# Altium project LKS_EVB_MCU081_V2.0.PrjPcb
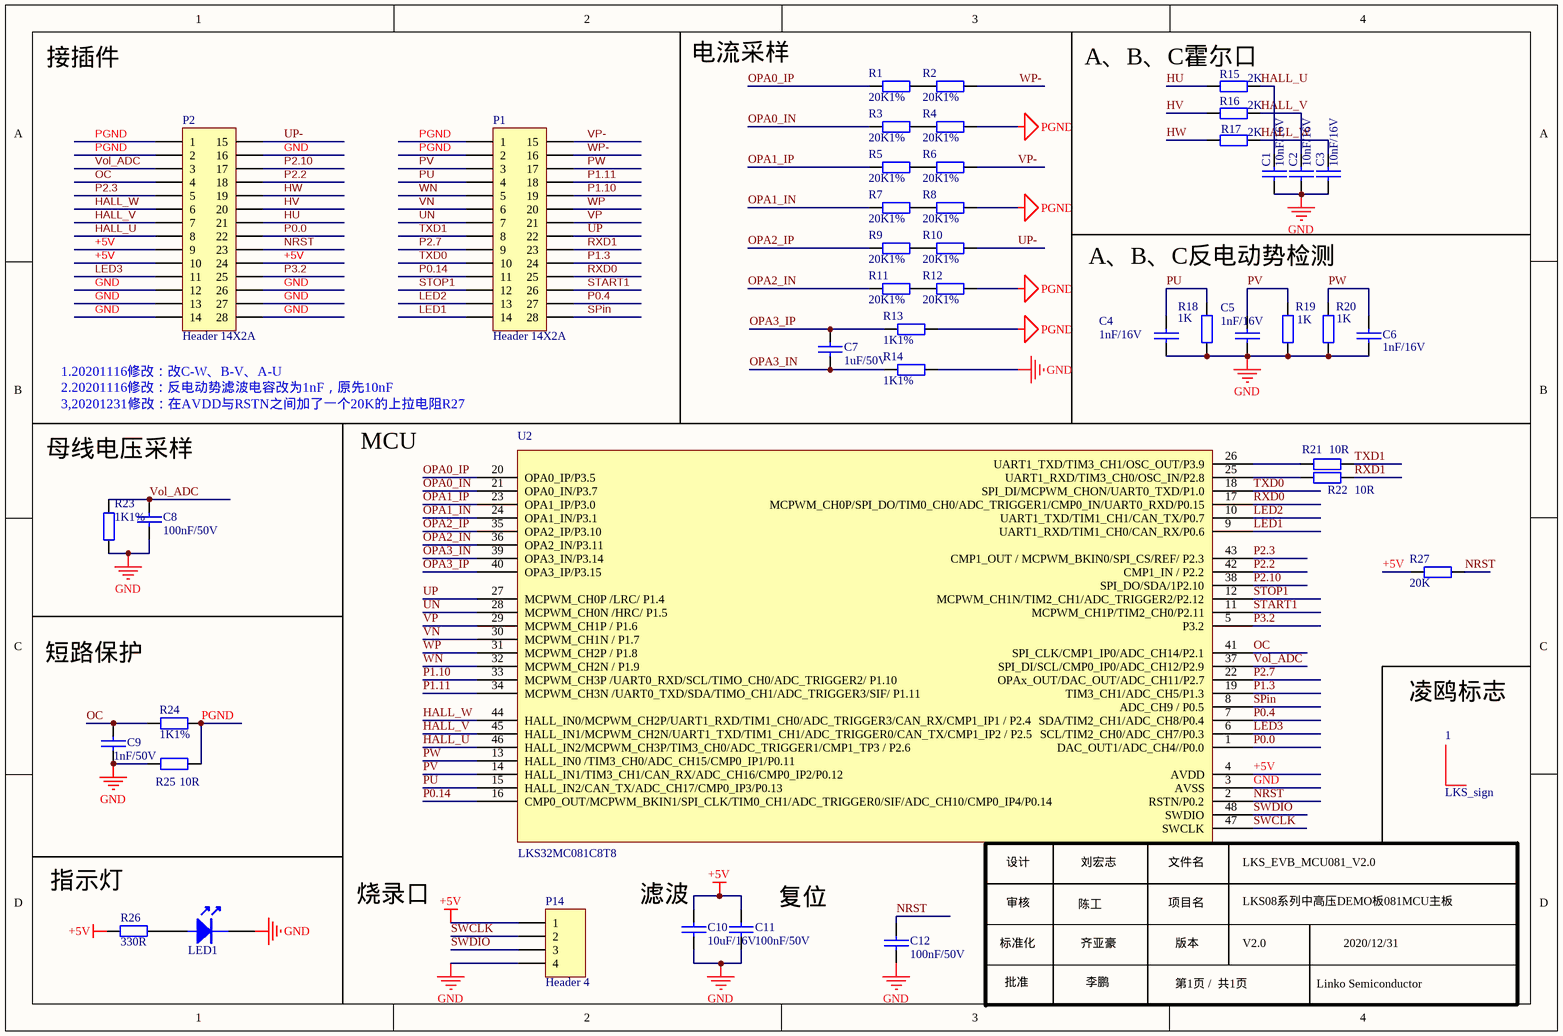
[diagram p0: LKS_EVB_MCU081_V2.0.SchDoc]
1 sheet, 45 parts. Net scope: global (net labels, ports and power ports of the same name join across sheets).
Board file: LKS_EVB_MCU081_V2.0.PcbDoc

## Sheet LKS_EVB_MCU081_V2.0.SchDoc
size A4; SheetNumber: 1; SheetTotal: 1

### Parts
1  LKS_sign  [LKS_LOGO2]
C1  10nF/16V  [0603C]
C2  10nF/16V  [0603C]
C3  10nF/16V  [0603C]
C4  1nF/16V  [0603C]
C5  1nF/16V  [0603C]
C6  1nF/16V  [0603C]
C7  1uF/50V  [0603C]
C8  100nF/50V  [0603C]
C9  1nF/50V  [0603C]
C10  10uF/16V  [0603C]
C11  100nF/50V  [0603C]
C12  100nF/50V  [0603C]
LED1  LED  [LED 0603R]  (value not drawn)
P1  Header 14X2A  [HDR2X14_CEN]
P2  Header 14X2A  [HDR2X14_CEN]
P14  Header 4  [HDR1X4]
R1  20K1%  [0603R]
R2  20K1%  [0603R]
R3  20K1%  [0603R]
R4  20K1%  [0603R]
R5  20K1%  [0603R]
R6  20K1%  [0603R]
R7  20K1%  [0603R]
R8  20K1%  [0603R]
R9  20K1%  [0603R]
R10  20K1%  [0603R]
R11  20K1%  [0603R]
R12  20K1%  [0603R]
R13  1K1%  [0603R]
R14  1K1%  [0603R]
R15  2K  [0603R]
R16  2K  [0603R]
R17  2K  [0603R]
R18  1K  [0603R]
R19  1K  [0603R]
R20  1K  [0603R]
R21  10R  [0603R]
R22  10R  [0603R]
R23  1K1%  [0603R]
R24  1K1%  [0603R]
R25  10R  [0603R]
R26  330R  [0603R]
R27  20K  [0603R]
U2  LKS32MC081C8T8  [LINKO-081]

### Nets
+5V: C10.2 C11.2 P2.9 P2.10 P2.24 P14.1 R26.1 R27.2 U2.4(AVDD)
GND: C1.2 C2.2 C3.2 C4.2 C5.2 C6.2 C8.1 C9.1 C10.1 C11.1 C12.2 LED1.2(K) P2.12 P2.13 P2.14 P2.16 P2.26 P2.27 P2.28 P14.4 R14.1 R18.2 R19.2 R20.2 R23.1 R25.2 U2.3(AVSS)
PGND: P1.1 P1.2 P2.1 P2.2 R4.1 R8.1 R12.1 R13.1 R24.2 R25.1
HALL_U: C1.1 P2.8 R15.2 U2.46(HALL_IN2/MCPWM_CH3P/TIM3_CH0/ADC_TRIGGER1/CMP1_TP3_/_P2.6)
HALL_V: C2.1 P2.7 R16.2 U2.45(HALL_IN1/MCPWM_CH2N/UART1_TXD/TIM1_CH1/ADC_TRIGGER0/CAN_TX/CMP1_IP2_/_P2.5)
HALL_W: C3.1 P2.6 R17.2 U2.44(HALL_IN0/MCPWM_CH2P/UART1_RXD/TIM1_CH0/ADC_TRIGGER3/CAN_RX/CMP1_IP1_/_P2.4)
HU: P2.21 R15.1
HV: P2.20 R16.1
HW: P2.19 R17.1
LED1: P1.14 U2.9(UART1_RXD/TIM1_CH0/CAN_RX/P0.6)
LED2: P1.13 U2.10(UART1_TXD/TIM1_CH1/CAN_TX/P0.7)
LED3: P2.11 U2.6(SCL/TIM2_CH0/ADC_CH7/P0.3)
NRST: C12.1 P2.23 R27.1 U2.2(RSTN/P0.2)
OC: C9.2 P2.4 R24.1 U2.41(SPI_CLK/CMP1_IP0/ADC_CH14/P2.1)
OPA0_IN: R3.2 U2.21(OPA0_IN/P3.7)
OPA0_IP: R1.2 U2.20(OPA0_IP/P3.5)
OPA1_IN: R7.2 U2.24(OPA1_IN/P3.1)
OPA1_IP: R5.2 U2.23(OPA1_IP/P3.0)
OPA2_IN: R11.2 U2.36(OPA2_IN/P3.11)
OPA2_IP: R9.2 U2.35(OPA2_IP/P3.10)
OPA3_IN: C7.2 R14.2 U2.39(OPA3_IN/P3.14)
OPA3_IP: C7.1 R13.2 U2.40(OPA3_IP/P3.15)
P0.0: P2.22 U2.1(DAC_OUT1/ADC_CH4//P0.0)
P0.4: P1.27 U2.7(SDA/TIM2_CH1/ADC_CH8/P0.4)
P0.14: P1.11 U2.16(CMP0_OUT/MCPWM_BKIN1/SPI_CLK/TIM0_CH1/ADC_TRIGGER0/SIF/ADC_CH10/CMP0_IP4/P0.14)
P1.3: P1.24 U2.19(TIM3_CH1/ADC_CH5/P1.3)
P1.10: P1.19 U2.33(MCPWM_CH3P_/UART0_RXD/SCL/TIMO_CH0/ADC_TRIGGER2/_P1.10)
P1.11: P1.18 U2.34(MCPWM_CH3N_/UART0_TXD/SDA/TIMO_CH1/ADC_TRIGGER3/SIF/_P1.11)
P2.2: P2.18 U2.42(CMP1_IN_/_P2.2)
P2.3: P2.5 U2.43(CMP1_OUT_/_MCPWM_BKIN0/SPI_CS/REF/_P2.3)
P2.7: P1.9 U2.22(OPAx_OUT/DAC_OUT/ADC_CH11/P2.7)
P2.10: P2.17 U2.38(SPI_DO/SDA/1P2.10)
P3.2: P2.25 U2.5(P3.2)
PU: C4.1 P1.4 R18.1 U2.15(HALL_IN2/CAN_TX/ADC_CH17/CMP0_IP3/P0.13)
PV: C5.1 P1.3 R19.1 U2.14(HALL_IN1/TIM3_CH1/CAN_RX/ADC_CH16/CMP0_IP2/P0.12)
PW: C6.1 P1.17 R20.1 U2.13(HALL_IN0_/TIM3_CH0/ADC_CH15/CMP0_IP1/P0.11)
RXD0: P1.25 U2.17(MCPWM_CH0P/SPI_DO/TIM0_CH0/ADC_TRIGGER1/CMP0_IN/UART0_RXD/P0.15)
RXD1: P1.23 R22.2
SPin: P1.28 U2.8(ADC_CH9_/_P0.5)
START1: P1.26 U2.11(MCPWM_CH1P/TIM2_CH0/P2.11)
STOP1: P1.12 U2.12(MCPWM_CH1N/TIM2_CH1/ADC_TRIGGER2/P2.12)
SWCLK: P14.2 U2.47(SWCLK)
SWDIO: P14.3 U2.48(SWDIO)
TXD0: P1.10 U2.18(SPI_DI/MCPWM_CHON/UART0_TXD/P1.0)
TXD1: P1.8 R21.1
UN: P1.7 U2.28(MCPWM_CH0N_/HRC/_P1.5)
UP: P1.22 U2.27(MCPWM_CH0P_/LRC/_P1.4)
UP-: P2.15 R10.1
VN: P1.6 U2.30(MCPWM_CH1N_/_P1.7)
Vol_ADC: C8.2 P2.3 R23.2 U2.37(SPI_DI/SCL/CMP0_IP0/ADC_CH12/P2.9)
VP: P1.21 U2.29(MCPWM_CH1P_/_P1.6)
VP-: P1.15 R6.1
WN: P1.5 U2.32(MCPWM_CH2N_/_P1.9)
WP: P1.20 U2.31(MCPWM_CH2P_/_P1.8)
WP-: P1.16 R2.1
NetLED1_1: LED1.1(A) R26.2
NetR1_1: R1.1 R2.2
NetR3_1: R3.1 R4.2
NetR5_1: R5.1 R6.2
NetR7_1: R7.1 R8.2
NetR9_1: R9.1 R10.2
NetR11_1: R11.1 R12.2
NetR21_2: R21.2 U2.26(UART1_TXD/TIM3_CH1/OSC_OUT/P3.9)
NetR22_1: R22.1 U2.25(UART1_RXD/TIM3_CH0/OSC_IN/P2.8)

### Notes on the sheet
- 接插件
- 电流采样
- A、B、C霍尔口
- A、B、C反电动势检测
- (near P2) 1.20201116修改：改C-W、B-V、A-U
- 2.20201116修改：反电动势滤波电容改为1nF，原先10nF
- 3,20201231修改：在AVDD与RSTN之间加了一个20K的上拉电阻R27
- MCU
- 母线电压采样
- 短路保护
- (near 1) 凌鸥标志
- (near R26) 指示灯
- 烧录口
- (near C10) 滤波
- 复位
- (near U2) 设计
- 审核
- 陈工
- (near U2) 刘宏志
- (near U2) 文件名
- 项目名
- (near U2) LKS_EVB_MCU081_V2.0
- LKS08系列中高压DEMO板081MCU主板
- 标准化
- 批准
- 齐亚豪
- 李鹏
- 版本
- 第1页 /  共1页
- V2.0
- Linko Semiconductor
- 2020/12/31

### Library data of the parts
C1-C6 = CAP: Capacitor
C7-C12 = C: Capacitor
LED1 = LED: LED_Light
P1 P2 = Header 14X2A: Header, 14-Pin, Dual row; LatestRevisionDate: 17-Jul-2002; LatestRevisionNote: Re-released for DXP Platform.; Publisher: Altium Limited
P14 = Header 4: Header, 4-Pin; LatestRevisionDate: 17-Jul-2002; LatestRevisionNote: Re-released for DXP Platform.; Publisher: Altium Limited
R1-R25 R27 = Res: Resistor; Value: K; Published: 8-Jun-2000; LatestRevisionDate: 17-Jul-2002; LatestRevisionNote: Re-released for DXP Platform.; PackageReference: AXIAL-0.4; Publisher: Altium Limited; PackageDescription: Axial Device, Thru-Hole; 2 Leads; 0.4 in Pin Spacing
R26 = Res: Resistor; Value: 330; Published: 8-Jun-2000; LatestRevisionDate: 17-Jul-2002; LatestRevisionNote: Re-released for DXP Platform.; PackageReference: AXIAL-0.4; Publisher: Altium Limited; PackageDescription: Axial Device, Thru-Hole; 2 Leads; 0.4 in Pin Spacing
U2 = LKS081C8T8: 芯片